# EAGLE design board_disp (EAGLE 7.5.0)
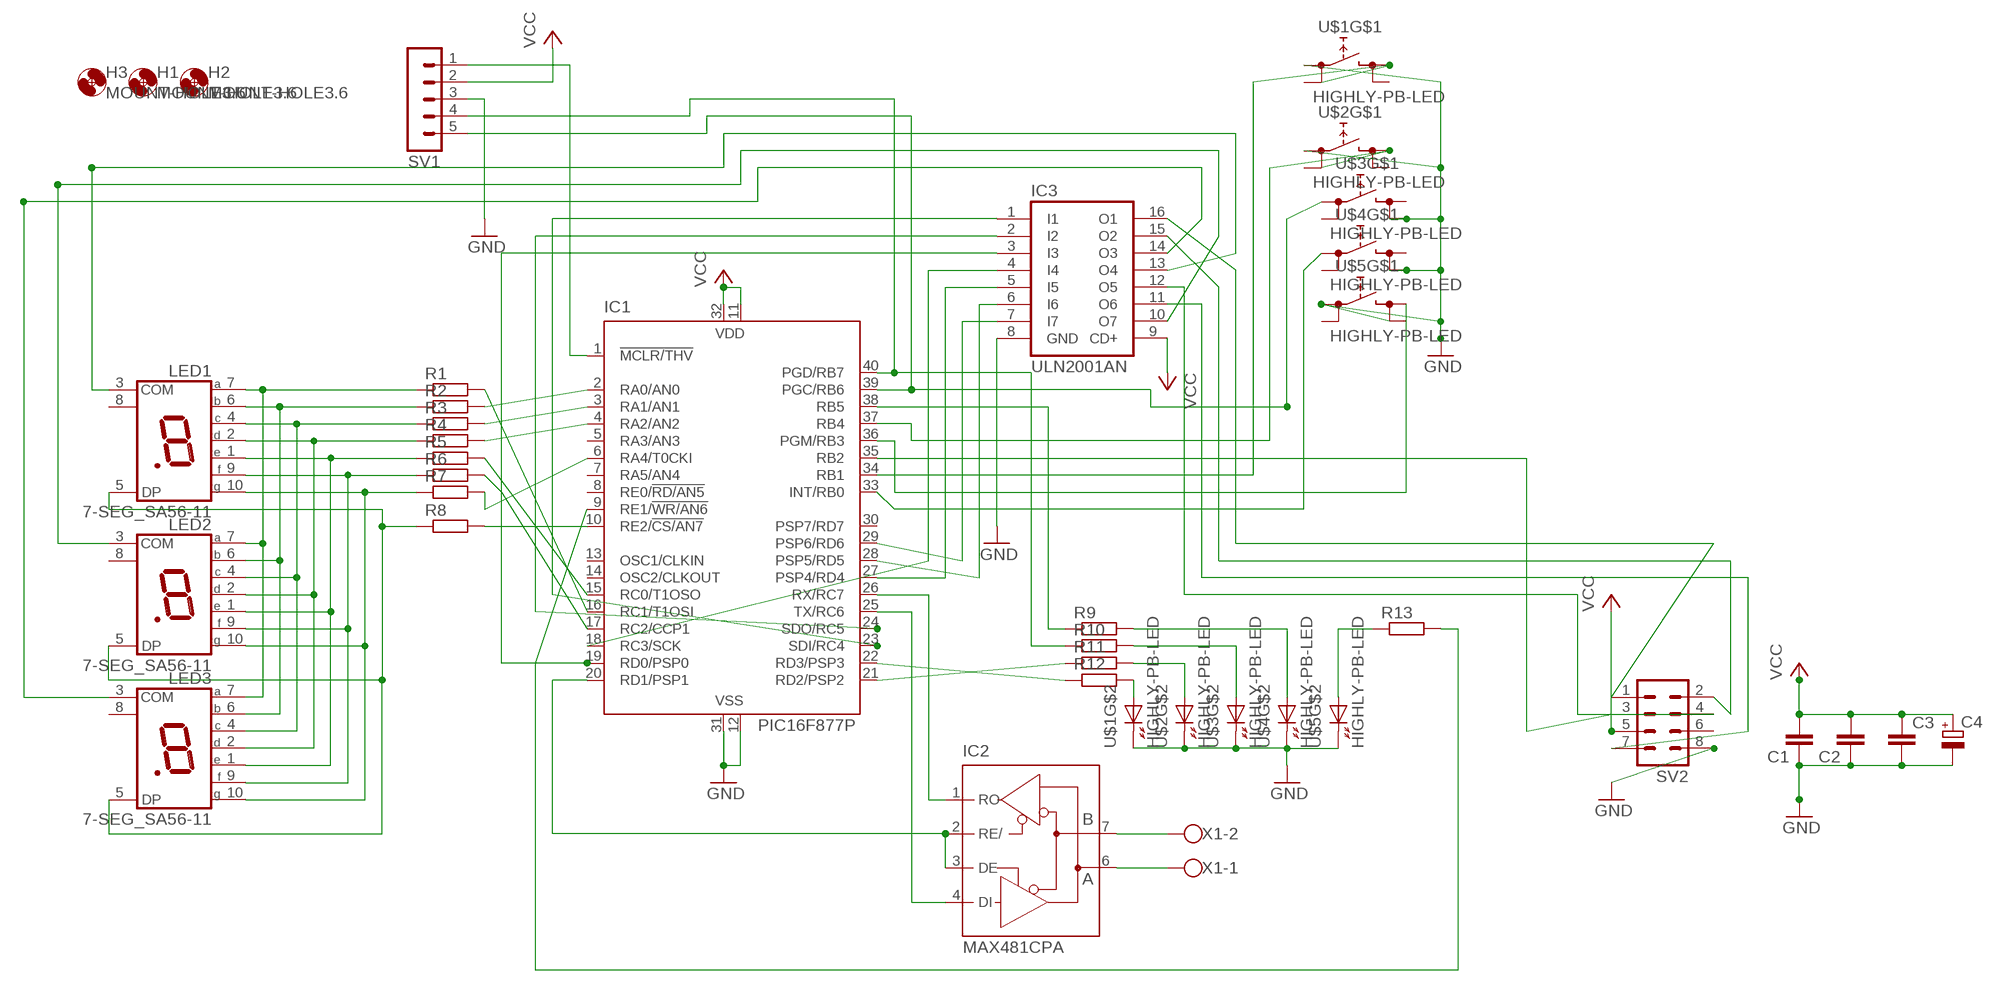
[diagram p0: schematic, sheet 1]

## Parts
C1  C-EU025_050-025X075  [C025_050-025X075]
C2  C-EU025_050-025X075  [C025_050-025X075]
C3  C-EU025_050-025X075  [C025_050-025X075]
C4  CPOL-EUE3.5-8  [E3,5-8]
H1  MOUNT-HOLE3.6  [3,6]
H2  MOUNT-HOLE3.6  [3,6]
H3  MOUNT-HOLE3.6  [3,6]
IC1  PIC16F877P  [DIL40]
IC2  MAX481CPA  [DIL08]
IC3  ULN2001AN  [DIL16]
LED1  7-SEG_SA56-11  [SA56-11]
LED2  7-SEG_SA56-11  [SA56-11]
LED3  7-SEG_SA56-11  [SA56-11]
R1  R-EU_0207/10  [0207/10]
R2  R-EU_0207/10  [0207/10]
R3  R-EU_0207/10  [0207/10]
R4  R-EU_0207/10  [0207/10]
R5  R-EU_0207/10  [0207/10]
R6  R-EU_0207/10  [0207/10]
R7  R-EU_0207/10  [0207/10]
R8  R-EU_0207/10  [0207/10]
R9  R-EU_0207/10  [0207/10]
R10  R-EU_0207/10  [0207/10]
R11  R-EU_0207/10  [0207/10]
R12  R-EU_0207/10  [0207/10]
R13  R-EU_0207/10  [0207/10]
SV1  MA05-1  [MA05-1]
SV2  MA04-2  [MA04-2]
U$1  HIGHLY-PB-LED  [HIGHLY-PUSHBUTTON]
U$2  HIGHLY-PB-LED  [HIGHLY-PUSHBUTTON]
U$3  HIGHLY-PB-LED  [HIGHLY-PUSHBUTTON]
U$4  HIGHLY-PB-LED  [HIGHLY-PUSHBUTTON]
U$5  HIGHLY-PB-LED  [HIGHLY-PUSHBUTTON]
X1  PASSO3  [PASSO3]

## Nets
GND: C1.1 C2.1 C3.2 C4.- IC1.12(VSS) IC1.31(VSS) IC3.8(GND) SV1.3 SV2.8 U$1.1A U$1.K U$2.1A U$2.K U$3.2B U$3.K U$4.2B U$4.K U$5.1A U$5.K
N$1: IC1.36(PGM/RB3) U$5.2A
N$2: IC1.33(INT/RB0) U$4.1A
N$3: IC1.39(PGC/RB6) SV1.5 U$3.1A
N$4: IC1.37(RB4) U$2.2A
N$5: IC1.34(RB1) U$1.2A
N$6: IC1.6(RA4/T0CKI) R7.2
N$7: LED1.5(DP) LED2.5(DP) LED3.5(DP) R8.1
N$8: IC1.10(RE2/!CS/AN7) R8.2
N$9: IC1.22(RD3/PSP3) R12.1
N$10: R12.2 U$1.A
N$11: R11.2 U$2.A
N$12: R10.2 U$3.A
N$13: R9.2 U$4.A
N$14: IC1.16(RC1/T1OSI) R1.2
N$15: LED1.7(A) LED2.7(A) LED3.7(A) R1.1
N$16: LED1.6(B) LED2.6(B) LED3.6(B) R2.1
N$17: LED1.4(C) LED2.4(C) LED3.4(C) R3.1
N$18: LED1.2(D) LED2.2(D) LED3.2(D) R4.1
N$19: LED1.1(E) LED2.1(E) LED3.1(E) R5.1
N$20: LED1.9(F) LED2.9(F) LED3.9(F) R6.1
N$21: LED1.10(G) LED2.10(G) LED3.10(G) R7.1
N$22: IC1.21(RD2/PSP2) R11.1
N$23: IC1.18(RC3/SCK) IC3.4(I4)
N$24: IC1.27(PSP4/RD4) IC3.5(I5)
N$25: IC1.17(RC2/CCP1) R6.2
N$26: IC1.15(RC0/T1OSO) R5.2
N$27: IC1.4(RA2/AN2) R4.2
N$28: IC1.3(RA1/AN1) R3.2
N$29: IC1.2(RA0/AN0) R2.2
N$30: IC1.38(RB5) R9.1
N$31: IC2.7(B) X1.2
N$32: IC2.6(A) X1.1
N$34: IC1.23(SDI/RC4) IC3.1(I1)
N$35: IC1.24(SDO/RC5) IC3.2(I2)
N$36: IC1.19(RD0/PSP0) IC3.3(I3)
N$37: IC3.13(O4) LED1.3(COM)
N$38: IC3.10(O7) LED2.3(COM)
N$39: IC3.14(O3) LED3.3(COM)
N$40: IC1.35(RB2) SV2.3
N$42: IC1.29(PSP6/RD6) IC3.7(I7)
N$43: IC1.28(PSP5/RD5) IC3.6(I6)
N$44: IC1.26(RX/RC7) IC2.1(RO)
N$45: IC1.25(TX/RC6) IC2.4(DI)
N$46: IC1.20(RD1/PSP1) IC2.2(RE/) IC2.3(DE)
N$47: IC1.40(PGD/RB7) R10.1 SV1.4
N$48: IC1.1(!MCLR/THV) SV1.1
N$49: IC3.16(O1) SV2.1
N$50: IC3.15(O2) SV2.2
N$51: IC3.11(O6) SV2.7
N$52: IC3.12(O5) SV2.4
N$60: R13.1 U$5.A
N$61: IC1.9(RE1/!WR/AN6) R13.2
VCC: C1.2 C2.2 C3.1 C4.+ IC1.11(VDD) IC1.32(VDD) IC3.9(CD+) SV1.2 SV2.5
Unconnected: IC1.5(RA3/AN3) IC1.7(RA5/AN4) IC1.8(RE0/!RD/AN5) IC1.13(OSC1/CLKIN) IC1.14(OSC2/CLKOUT) IC1.30(PSP7/RD7) LED1.8(COM) LED2.8(COM) LED3.8(COM) SV2.6 U$1.1B U$1.2B U$2.1B U$2.2B U$3.1B U$3.2A U$4.1B U$4.2A U$5.1B U$5.2B

## Power pins joined to a net without a drawn wire
GND: IC2.5(GND)
VCC: IC2.8(VCC)

## Library data of the parts
C1-C3 = rcl:C-EU: CAPACITOR, European symbol
C4 = rcl:CPOL-EU: POLARIZED CAPACITOR, European symbol
H1-H3 = holes:MOUNT-HOLE: MOUNTING HOLE with drill center marker
IC1 = microchip_mod:PIC16F87*: MICROCONTROLLER; MF: MICROCHIP; MPN: PIC16F877-04/P; OC_FARNELL: 9761349; OC_NEWARK: 61K3463
IC2 = maxim:MAX481CPA: RS485 TRANSEIVER; MPN: MAX481CPA+; OC_FARNELL: unknown; OC_NEWARK: 99K3445
IC3 = uln-udn:ULN2001A: DRIVER ARRAY
LED1-LED3 = display-kingbright:7-SEG_: Kingbright 14.2mm (0.56 INCH) SINGLE DIGIT NUMERIC DUISPLAY Source: SA56-11EWA(Ver1189471036.pdf; OC_FARNELL: unknown; OC_NEWARK: unknown
R1-R13 = resistor:R-EU_: RESISTOR, European symbol
SV1 = con-lstb:MA05-1: PIN HEADER; OC_FARNELL: unknown; OC_NEWARK: unknown
SV2 = con-lstb:MA04-2: PIN HEADER; OC_FARNELL: unknown; OC_NEWARK: unknown
U$1-U$5 = eagle:HIGHLY-PB-LED
X1 = con-wago-500:PASSO3: WAGO SCREW CLAMP; MPN: 237-102; OC_FARNELL: unknown; OC_NEWARK: 70K9898

## Board
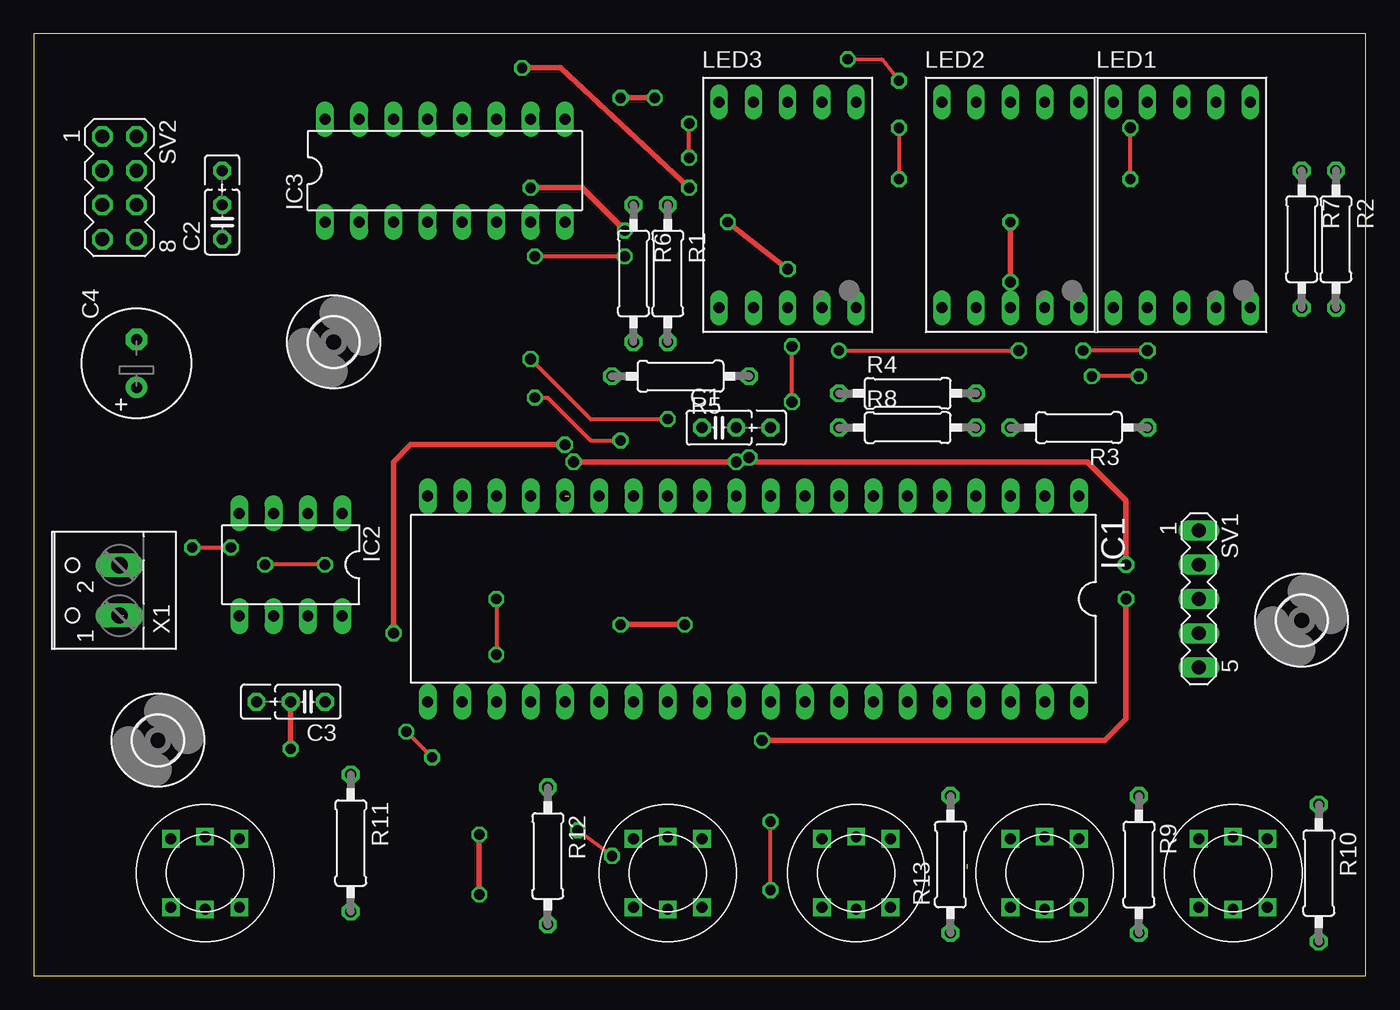
[diagram p1: board, top side]
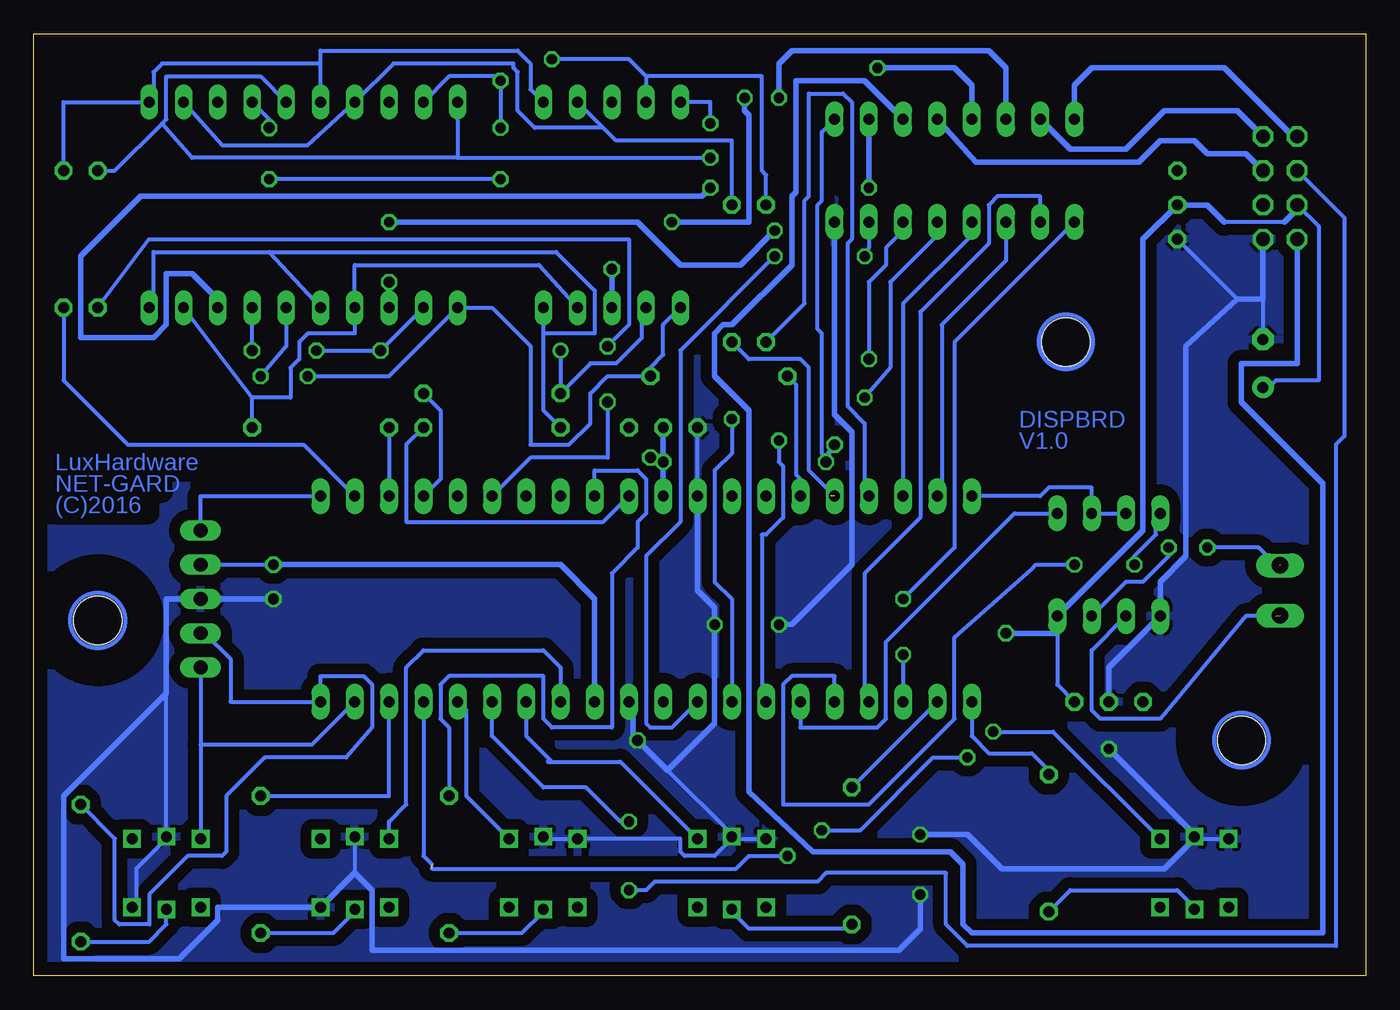
[diagram p2: board, bottom side, seen from below]

Size 98.73 x 69.84 mm. Coordinates in mm from the lower left corner, seen from the top.
Outline: 0,0 98.73,0 98.73,69.84 0,69.84 0,0
Copper layers (1*16): Top 0.035mm / dielectric 1.5mm / Bottom 0.035mm
Design rules "default *": minimum track width 12mil, minimum drill 30mil, track to track 16mil, track to pad 16mil, pad to pad 16mil, via to via 16mil, smd to smd 16mil, copper to edge 40mil, drill to drill 8mil, minimum pad ring 10mil, minimum via ring 8mil, stop-mask expansion 4mil, vias tented up to drill 0mil, thermal gap 10mil

### Footprints (pad centres in the part's own frame; a part is rotated, then mirrored left to right if it is on the bottom)
C025_050-025X075 = drill 0.813 octagon: 1 -1.27,0; 2 1.27,0; 3 3.81,0
E3,5-8 = drill 0.813 pad 1.6: + -1.778,0 | drill 0.813 pad 1.6 octagon: - 1.778,0
3,6 = hole 3.6: 0,0
DIL40 = drill 0.813 long: 1 -24.13,-7.62; 2 -21.59,-7.62; 3 -19.05,-7.62; 4 -16.51,-7.62; 5 -13.97,-7.62; 6 -11.43,-7.62; 7 -8.89,-7.62; 8 -6.35,-7.62; 9 -3.81,-7.62; 10 -1.27,-7.62; 11 1.27,-7.62; 12 3.81,-7.62; 13 6.35,-7.62; 14 8.89,-7.62; 15 11.43,-7.62; 16 13.97,-7.62; 17 16.51,-7.62; 18 19.05,-7.62; 19 21.59,-7.62; 20 24.13,-7.62; 21 24.13,7.62; 22 21.59,7.62; 23 19.05,7.62; 24 16.51,7.62; 25 13.97,7.62; 26 11.43,7.62; 27 8.89,7.62; 28 6.35,7.62; 29 3.81,7.62; 30 1.27,7.62; 31 -1.27,7.62; 32 -3.81,7.62; 33 -6.35,7.62; 34 -8.89,7.62; 35 -11.43,7.62; 36 -13.97,7.62; 37 -16.51,7.62; 38 -19.05,7.62; 39 -21.59,7.62; 40 -24.13,7.62
DIL08 = drill 0.813 long: 1 -3.81,-3.81; 2 -1.27,-3.81; 3 1.27,-3.81; 4 3.81,-3.81; 5 3.81,3.81; 6 1.27,3.81; 7 -1.27,3.81; 8 -3.81,3.81
DIL16 = drill 0.813 long: 1 -8.89,-3.81; 2 -6.35,-3.81; 3 -3.81,-3.81; 4 -1.27,-3.81; 5 1.27,-3.81; 6 3.81,-3.81; 7 6.35,-3.81; 8 8.89,-3.81; 9 8.89,3.81; 10 6.35,3.81; 11 3.81,3.81; 12 1.27,3.81; 13 -1.27,3.81; 14 -3.81,3.81; 15 -6.35,3.81; 16 -8.89,3.81
SA56-11 = drill 0.8 long: 1 -5.08,-7.62; 2 -2.54,-7.62; 3 0,-7.62; 4 2.54,-7.62; 5 5.08,-7.62; 6 5.08,7.62; 7 2.54,7.62; 8 0,7.62; 9 -2.54,7.62; 10 -5.08,7.62
0207/10 = drill 0.813 octagon: 1 -5.08,0; 2 5.08,0
MA05-1 = drill 1.016 long: 1 -5.08,0; 2 -2.54,0; 3 0,0; 4 2.54,0; 5 5.08,0
MA04-2 = drill 1.016 octagon: 1 -3.81,-1.27; 2 -3.81,1.27; 3 -1.27,-1.27; 4 -1.27,1.27; 5 1.27,-1.27; 6 1.27,1.27; 7 3.81,-1.27; 8 3.81,1.27
HIGHLY-PUSHBUTTON = drill 0.8 square: 1A -2.54,2.54; 1B -2.54,-2.54; 2A 2.54,2.54; 2B 2.54,-2.54; A 0,-2.692; K 0,2.692
PASSO3 = drill 1.194 long: 1 -2.5,-1.27; 2 1.23,-1.27

### Placement (x,y rotation side)
C1  50.8,40.64 0 top
C2  13.97,55.88 90 top
C3  20.32,20.32 180 top
C4  7.62,45.4 90 top
H1  93.98,26.35 0 top
H2  9.21,17.46 0 top
H3  22.23,46.99 0 top
IC1  53.34,27.94 180 top
IC2  19.05,30.48 180 top
IC3  30.48,59.69 0 top
LED1  85.09,57.15 0 top
LED2  72.39,57.15 0 top
LED3  55.88,57.15 0 top
R1  46.99,52.07 270 top
R2  96.52,54.61 270 top
R3  77.47,40.64 180 top
R4  64.77,43.18 0 top
R5  47.94,44.45 180 top
R6  44.45,52.07 270 top
R7  93.98,54.61 270 top
R8  64.77,40.64 0 top
R9  81.92,8.26 270 top
R10  95.25,7.62 270 top
R11  23.5,9.84 270 top
R12  38.1,8.89 270 top
R13  67.95,8.26 90 top
SV1  86.36,27.94 270 top
SV2  6.35,58.42 270 top
U$1  46.99,7.62 0 top
U$2  12.7,7.62 0 top
U$3  88.9,7.62 0 top
U$4  74.93,7.62 0 top
U$5  60.96,7.62 0 top
X1  5.08,29.21 90 top

### Tracks (layer width: path | path; a pad name or v marks a point on that pad's centre or on a via)
GND  (via drill 0.76, 0.8)
  Top 0.406: C3.2 v19.05,16.83 | v48.26,26.04 v43.5,26.04 | v33.02,6.03 v33.02,10.48 | v53.97,17.46 79.38,17.46 80.96,19.05 v80.96,27.94
  Bottom 0.305: 9.53,50.16 C2.1 | 7.62,50.16 C4.- | U$2.1A 12.7,10.16 U$2.K 12.7,10.48 | U$4.K 74.93,7.62 | U$3.2B 91.12,5.4 91.12,7.94 88.9,10.16 U$3.K 88.9,20.95 | U$5.K 60.96,10.16 U$5.1A 50.8,10.16 50.8,9.21 50.48,8.89 48.26,8.89 46.99,10.16 | 46.99,10.16 U$1.1A | 51.75,15.24 46.99,10.48 U$1.K 46.99,10.16 | v53.97,17.46 54.29,17.78 | IC1.12 C1.1
  Bottom 0.406: SV2.8 7.62,50.16 9.53,50.16 13.34,46.67 13.34,31.11 15.24,29.21 IC2.5 19.05,22.86 C3.2 | v19.05,16.83 12.7,10.48 | IC1.31 54.29,20 54.29,17.78 | v53.97,17.46 51.75,15.24 48.26,18.73 v48.26,26.04 48.26,27.3 49.53,28.57 IC1.12 | IC3.8 39.37,41.59 38.1,40.32 38.1,30.48 42.54,26.04 v43.5,26.04 | v80.96,27.94 SV1.3 88.9,27.94 88.9,20.95 96.52,13.34 96.52,1.27 87.95,1.27 85.09,4.13 85.09,5.08 U$4.2B 74.93,7.62 73.66,6.35 73.66,1.91 34.61,1.91 33.02,3.49 v33.02,6.03 | 12.7,10.16 14.92,7.94 26.99,7.94 29.53,10.48 v33.02,10.48
  pour Bottom (isolate 0.813): 0.32,70.8 99.06,70.17 99.06,-0.32 -0.64,-0.32 -0.64,69.85
N$1
  Bottom 0.305: U$5.2A 66.67,13.34 66.67,19.68 IC1.36
N$2
  Bottom 0.305: U$4.1A 72.39,11.43 71.12,12.7 71.12,22.86 69.85,24.13 60.96,24.13 59.69,22.86 IC1.33
N$3
  Bottom 0.305: 86.36,17.14 U$3.1A | SV1.5 86.36,17.14 | IC1.39 78.11,17.14 86.36,17.14
N$4  (via drill 0.76)  (1 unrouted)
  Top 0.305: v29.53,16.19 v27.62,18.1 | v42.86,8.89 v40.32,10.79
  Bottom 0.305: U$2.2A 23.18,18.1 v27.62,18.1 | v29.53,16.19 32.07,16.19 37.46,10.79 v40.32,10.79 | v42.86,8.89 45.72,8.89 46.67,7.94 69.22,7.94 | IC1.37 69.85,8.89 69.22,8.26
N$5
  Bottom 0.305: U$1.2A 55.24,15.88 60.32,15.88 | 60.64,15.88 60.32,15.88 | IC1.34 62.23,17.78 60.32,15.88
N$6  (via drill 0.8)
  Top 0.305: v56.2,42.55 v56.2,46.67
  Bottom 0.305: IC1.6 61.91,38.42 56.2,38.42 v56.2,42.55 | v56.2,46.67 54.61,48.26 54.61,54.61 90.17,54.61 R7.2
N$7
  Bottom 0.305: 60.96,47.62 60.96,41.91 R8.1 | 60.96,47.62 LED3.5 | 81.28,53.66 LED2.5 | 81.28,53.66 89.85,53.66 89.85,50.16 LED1.5 | 60.96,47.62 57.15,47.62 57.15,50.8 60.01,53.66 81.28,53.66
N$8
  Bottom 0.305: IC1.10 56.51,33.66 71.12,33.66 71.12,39.37 R8.2
N$9
  Bottom 0.305: IC1.22 R12.1
N$10
  Bottom 0.305: R12.2 38.1,3.49 45.72,3.49 46.99,4.76 U$1.A
N$11
  Bottom 0.305: R11.2 21.91,6.35 13.97,6.35 12.7,5.08 U$2.A
N$12
  Bottom 0.305: U$3.A 88.9,3.81 90.17,2.54 R10.2
N$13
  Bottom 0.305: R9.2 76.52,3.17 74.93,4.76 U$4.A
N$14  (1 unrouted)
  Bottom 0.305: 39.69,35.56 39.69,35.88 41.27,37.47 41.27,45.09 41.91,45.72 45.72,45.72 R1.2
N$15
  Bottom 0.305: LED1.7 84.77,61.59 78.42,61.59 LED2.7 72.07,67.63 63.18,67.63 63.18,67.31 62.87,66.99 62.87,64.14 61.59,62.87 56.51,62.87 | 56.51,62.87 55.56,61.91 46.99,61.91 R1.1 | 56.51,62.87 LED3.7
N$16
  Bottom 0.305: R2.1 96.52,64.77 LED1.6 89.85,65.09 89.85,66.99 89.22,67.63 77.47,67.63 | LED3.6 61.91,65.72 61.91,67.63 62.87,68.58 77.47,68.58 77.47,67.63 | LED2.6 77.47,67.63
N$17
  Bottom 0.305: 82.55,42.86 LED1.4 | R3.1 82.55,42.86 | LED3.4 61.28,52.7 74.93,52.7 LED2.4 74.93,47.62 78.42,47.62 79.06,46.99 79.06,45.72 79.69,45.09 79.69,42.86 82.55,42.86
N$18  (via drill 0.76, 0.8)
  Top 0.305: v82.55,46.35 v77.79,46.35 | v59.69,46.35 v73.03,46.35
  Bottom 0.305: LED3.2 53.66,49.21 53.66,47.31 55.56,45.4 57.47,45.4 R4.1 v59.69,46.35 | LED2.2 v73.03,46.35 v77.79,46.35 | v82.55,46.35 LED1.2
N$19  (via drill 0.76)
  Top 0.305: v81.92,44.45 v78.42,44.45
  Bottom 0.305: LED3.1 52.07,48.26 52.07,46.04 53.02,45.09 R5.1 56.2,44.45 57.47,43.18 57.47,40.96 59.05,39.37 61.91,39.37 61.91,46.67 64.77,49.53 LED2.1 72.39,44.45 v78.42,44.45 | v81.92,44.45 80.01,46.67 LED1.1
N$20  (via drill 0.76, 0.8)
  Top 0.305: v64.14,66.36 62.87,67.94 v60.32,67.94 | v81.28,59.05 v81.28,62.87 | v64.14,62.87 v64.14,59.05
  Bottom 0.305: 53.34,66.67 LED3.9 | 53.34,66.67 44.77,66.67 44.77,59.69 44.45,59.37 R6.1 | LED2.9 67.95,66.67 64.14,66.67 v64.14,66.36 v64.14,62.87 | v60.32,67.94 54.61,67.94 53.34,66.67 | v64.14,59.05 v81.28,59.05 | v81.28,62.87 81.28,63.5 LED1.9
N$21  (via drill 0.76)
  Top 0.305: v48.58,60.64 v48.58,63.18
  Bottom 0.305: LED1.10 81.92,66.67 88.9,66.67 88.9,63.5 89.22,63.18 | 89.22,63.18 92.71,59.69 R7.1 | LED3.10 48.58,64.77 v48.58,63.18 | 67.31,60.64 v48.58,60.64 | LED2.10 67.31,60.64 | 89.22,63.18 87,60.64 67.31,60.64
N$22
  Bottom 0.305: R11.1 23.5,15.24 24.77,16.51 27.94,16.51 29.21,17.78 IC1.21
N$23
  Bottom 0.305: IC1.18 34.29,49.85 29.21,54.93 IC3.4
N$24  (via drill 0.76)
  Top 0.305: v37.15,42.86 38.1,42.86 41.27,39.69 v43.5,39.69
  Bottom 0.305: IC1.27 44.77,20.64 44.77,32.7 44.45,32.7 43.18,33.97 43.18,37.78 43.5,38.1 v43.5,39.69 | v37.15,42.86 35.24,45.09 35.24,51.44 31.75,54.93 IC3.5
N$25
  Bottom 0.305: IC1.17 37.15,35.88 37.15,40.96 38.42,42.23 38.42,54.29 38.1,54.61 38.1,64.77 38.73,65.41 41.27,65.41 41.27,57.78 41.59,57.47 41.59,49.85 R6.2
N$26
  Bottom 0.305: R5.2 42.23,43.81 42.23,37.15 41.91,36.83 IC1.15
N$27
  Bottom 0.305: IC1.4 68.58,36.83 68.58,41.91 R4.2
N$28
  Bottom 0.305: R3.2 IC1.3
N$29
  Bottom 0.305: IC1.2 78.74,39.37 91.76,39.37 96.52,44.13 R2.2
N$30
  Bottom 0.305: R9.1 72.39,13.34 IC1.38
N$31  (via drill 0.76)  (1 unrouted)
  Top 0.305: v11.75,31.75 v14.61,31.75
  Bottom 0.305: IC2.7 17.78,29.21 16.51,29.21 14.61,31.11 v14.61,31.75 | v11.75,31.75 7.94,31.75 6.67,30.48 6.35,30.48
N$32  (1 unrouted)
  Bottom 0.305: IC2.6 20.32,24.13 20.32,19.68 19.68,19.05 15.24,19.05 8.89,26.67 6.67,26.67
N$34  (via drill 0.76)
  Top 0.305: v34.29,27.94 v34.29,23.81
  Bottom 0.305: v34.29,23.81 IC1.23 | v34.29,27.94 30.48,31.75 30.48,46.99 IC3.1
N$35
  Bottom 0.305: IC1.24 37.15,20.64 37.15,29.84 33.02,33.97 33.02,49.21 27.94,54.29 27.94,57.15 27.3,57.78 24.13,57.78 IC3.2
N$36
  Bottom 0.305: IC1.19 31.43,35.88 31.43,48.26 26.67,53.02 IC3.3
N$37  (via drill 0.76)
  Top 0.406: v48.58,58.42 39.05,67.31 v36.2,67.31
  Bottom 0.406: LED1.3 85.09,50.16 87,52.07 88.9,52.07 88.9,48.26 89.85,47.31 95.25,47.31 95.25,53.34 90.81,57.78 49.21,57.78 v48.58,58.42 | v36.2,67.31 30.48,67.31 29.21,66.04 IC3.13
N$38  (via drill 0.76, 0.8)
  Top 0.406: v43.81,55.24 40.64,58.42 v36.83,58.42 | v72.39,55.88 v72.39,51.44
  Bottom 0.406: v72.39,55.88 53.97,55.88 50.8,52.7 46.35,52.7 v43.81,55.24 | v36.83,58.42 IC3.10 | LED2.3 v72.39,51.44
N$39  (via drill 0.76, 0.8)
  Top 0.406: v43.5,65.09 v46.04,65.09 | v51.43,55.88 v55.88,52.39
  Bottom 0.406: v51.43,55.88 45.72,55.88 45.72,63.82 46.04,64.14 v46.04,65.09 | v43.5,65.09 43.5,67.63 42.54,68.58 27.94,68.58 26.67,67.31 IC3.14 | LED3.3 v55.88,52.39
N$40  (via drill 0.76)
  Top 0.305: v54.61,6.35 v54.61,11.43
  Bottom 0.305: v54.61,11.43 55.24,11.43 57.78,13.97 60.96,13.97 64.77,17.78 IC1.35 | v54.61,6.35 53.34,6.35 52.7,6.99 40.64,6.99 40,7.62 31.11,7.62 31.11,3.81 29.53,2.22 2.22,2.22 2.22,39.37 1.59,40.01 1.59,56.2 SV2.3
N$42  (via drill 0.76)
  Top 0.305: v37.15,53.34 v43.81,53.34
  Bottom 0.305: IC1.29 51.43,18.41 53.02,18.41 53.34,18.73 53.34,31.11 50.8,33.66 50.8,46.35 v43.81,53.34 | IC3.7 36.83,53.98 v37.15,53.34
N$43  (via drill 0.76, 0.8)
  Top 0.305: v36.83,45.72 41.27,41.27 v46.99,41.27
  Bottom 0.305: IC1.28 46.99,27.94 48.26,29.21 48.26,37.47 46.99,38.73 v46.99,41.27 | IC3.6 34.29,55.24 35.56,53.98 35.56,52.7 36.83,51.44 v36.83,45.72
N$44
  Bottom 0.305: IC2.1 26.04,34.29 35.56,24.77 35.56,19.05 36.2,18.41 41.91,18.41 IC1.26
N$45  (via drill 0.76)
  Top 0.305: v21.59,30.48 v17.14,30.48
  Bottom 0.305: IC2.4 15.56,33.97 15.56,32.7 17.14,31.11 v17.14,30.48 | v21.59,30.48 24.45,30.48 24.77,30.16 30.48,25.08 30.48,19.05 36.83,12.7 43.18,12.7 43.18,21.59 42.54,22.23 39.37,22.23 IC1.25
N$46
  Bottom 0.305: IC2.3 IC2.2 20.32,36.2 23.5,36.2 24.13,35.56 IC1.20
N$47
  Bottom 0.305: SV1.4 86.04,25.4 84.14,23.5 84.14,20.32 IC1.40 77.47,22.23 74.3,22.23 73.66,21.59 73.66,18.41 75.56,16.19 81.6,16.19 84.45,13.34 84.45,9.21 84.77,8.89 87.31,8.89 90.17,6.03 90.17,3.81 92.39,3.81 92.71,4.13 92.71,10.16 R10.1
N$48
  Bottom 0.305: IC1.1 86.36,35.56 SV1.1
N$49
  Bottom 0.406: IC3.16 21.59,66.04 20.32,67.31 10.48,67.31 5.4,62.23 SV2.1
N$50
  Bottom 0.406: IC3.15 21.91,61.28 17.78,61.28 14.92,64.14 9.53,64.14 SV2.2
N$51
  Bottom 0.406: IC3.11 37.15,66.36 42.23,66.36 42.23,58.1 42.54,57.78 42.54,52.7 46.99,48.26 47.62,48.26 48.26,47.62 48.26,44.45 45.72,41.91 45.72,13.65 40.96,9.21 30.8,9.21 29.84,8.26 29.84,3.81 29.21,3.17 3.18,3.17 3.18,36.51 9.21,42.55 9.21,45.4 5.08,45.4 5.08,46.04 SV2.7
N$52
  Bottom 0.406: IC3.12 28.89,60.33 16.83,60.33 15.24,61.91 12.7,61.91 11.75,60.96 8.89,60.96 SV2.4
N$60
  Bottom 0.305: R13.1 62.55,3.17 60.96,4.76 U$5.A
N$61
  Bottom 0.305: R13.2 67.95,18.41 68.58,19.05 68.58,21.59 67.95,22.23 60.96,22.23 60.96,19.05 60.32,18.41 55.88,18.41 55.88,29.84 53.97,31.75 53.97,33.66 53.34,34.29 53.34,36.83 53.97,37.47 57.15,37.47 IC1.9
VCC  (via drill 0.8)
  Top 0.305: v53.02,38.42 53.34,38.42 53.34,38.1
  Top 0.406: 53.34,38.1 78.11,38.1 80.96,35.24 v80.96,30.48 | v26.67,25.4 26.67,38.1 27.94,39.37 v39.37,39.37 | v40,38.1 v52.07,38.1
  Bottom 0.305: C3.1 22.86,21.59 22.86,25.4 | C4.+ 7.3,43.5 6.67,44.13 3.49,44.13 3.49,55.56 SV2.5 5.08,56.83 | SV1.2 v80.96,30.48 | IC3.9 40.32,62.55 40.32,57.47 40.64,57.15 40.64,47.94 40.32,47.62 40.32,38.73 40,38.42 v40,38.1 | v52.07,38.1 IC1.11 | 6.03,55.88 10.48,55.88
  Bottom 0.406: IC1.32 57.15,27.94 59.69,30.48 v80.96,30.48 | IC1.11 C1.2 | v26.67,25.4 22.86,25.4 IC2.8 16.51,33.02 16.51,54.61 C2.2 11.75,57.15 10.48,55.88 | v39.37,39.37 40,38.42 | v52.07,38.1 v53.02,38.42 | 5.08,56.83 6.03,55.88
(copper drawn outside any net)
  shapes: Bottom circle x3

### Text on the board
Bottom: DISPBRD | V1.0 | LuxHardware | NET-GARD | (C)2016